# Altium schematic sheet HV_DAC_8ch-DIOT.schdoc: Fastino v1.3 DIOT
size A2; EDA_Number: ARTIQ; Projet: Fastino; Author: G.Kasprowicz; CompanyName: WUT ISE; DrawnBy: G.Kasprowicz; Organization: WUT ISE; Address1: PW ISE; Address2: Nowowiejska 15/19 00-665 Warsaw; Address3: gkasprow@gmail.com; DocumentNumber: 1; Revision: 2; SheetNumber: 1; SheetTotal: 12; ModifiedBy: -; CheckedDate: -; Title2: Top; DivGrp: WUT ISE; Designer: G.Kasprowicz; ModifiedDate: -; ProjectName: Sensor Box
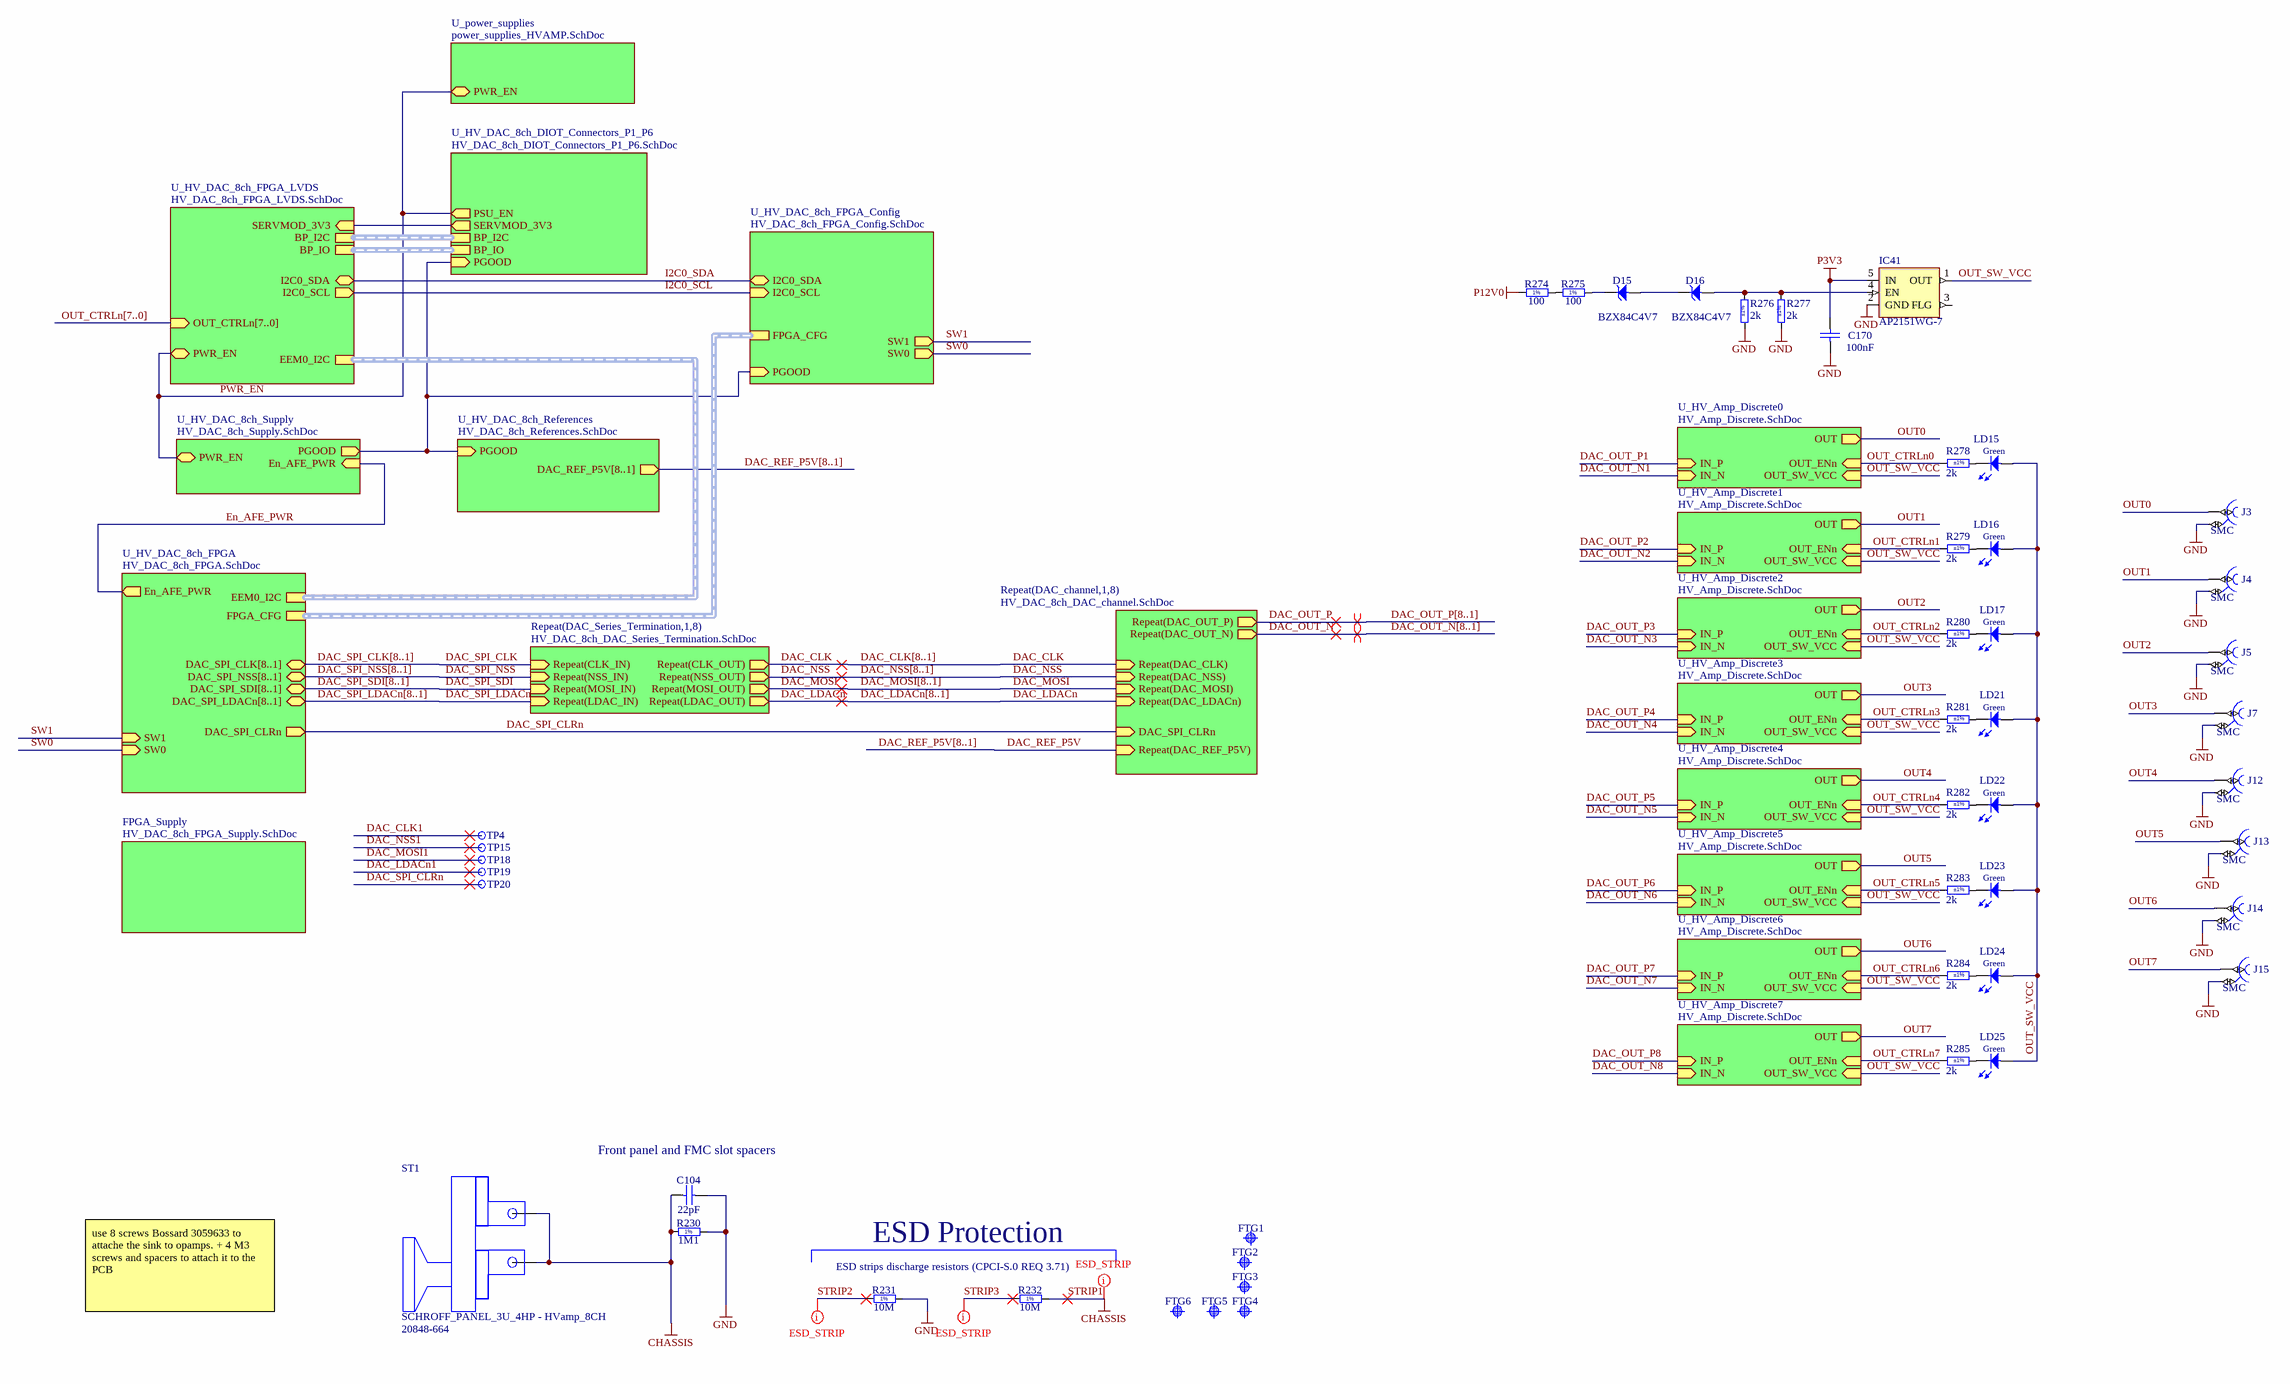
[diagram p0: HV_DAC_8ch-DIOT.schdoc]

## Parts
C104  22pF  [CAPC1005X55N]
C170  100nF  [CAPC1005X55N]
D15  BZX84C4V7  [SOT95P240X130-3N]
D16  BZX84C4V7  [SOT95P240X130-3N]
FTG1  Use only in PCB  [FIDUCIAL_TOP_C100-200]  (value not drawn)
FTG2  Use only in PCB  [FIDUCIAL_TOP_S100-200]  (value not drawn)
FTG3  Use only in PCB  [FIDUCIAL_TOP_S100-200]  (value not drawn)
FTG4  Use only in PCB  [FIDUCIAL_TOP_S100-200]  (value not drawn)
FTG5  Use only in PCB  [FIDUCIAL_TOP_S100-200]  (value not drawn)
FTG6  Use only in PCB  [FIDUCIAL_TOP_S100-200]  (value not drawn)
IC41  AP2151WG-7  [SOT23-5]
J3  SMC  [JOHNSON_131-6701-341]
J4  SMC  [JOHNSON_131-6701-341]
J5  SMC  [JOHNSON_131-6701-341]
J7  SMC  [JOHNSON_131-6701-341]
J12  SMC  [JOHNSON_131-6701-341]
J13  SMC  [JOHNSON_131-6701-341]
J14  SMC  [JOHNSON_131-6701-341]
J15  SMC  [JOHNSON_131-6701-341]
LD15  Green  [LED_AVAGO_HSME-C120]
LD16  Green  [LED_AVAGO_HSME-C120]
LD17  Green  [LED_AVAGO_HSME-C120]
LD21  Green  [LED_AVAGO_HSME-C120]
LD22  Green  [LED_AVAGO_HSME-C120]
LD23  Green  [LED_AVAGO_HSME-C120]
LD24  Green  [LED_AVAGO_HSME-C120]
LD25  Green  [LED_AVAGO_HSME-C120]
R230  1M1  [RESC2012X60N]
R231  10M  [RESC2113X55N]
R232  10M  [RESC2113X55N]
R274  100  [RESC1005X40N]
R275  100  [RESC1005X40N]
R276  2k  Tolerance: ±1%  [RESC1005X40N]
R277  2k  Tolerance: ±1%  [RESC1005X40N]
R278  2k  Tolerance: ±1%  [RESC1005X40N]
R279  2k  Tolerance: ±1%  [RESC1005X40N]
R280  2k  Tolerance: ±1%  [RESC1005X40N]
R281  2k  Tolerance: ±1%  [RESC1005X40N]
R282  2k  Tolerance: ±1%  [RESC1005X40N]
R283  2k  Tolerance: ±1%  [RESC1005X40N]
R284  2k  Tolerance: ±1%  [RESC1005X40N]
R285  2k  Tolerance: ±1%  [RESC1005X40N]
ST1  SCHROFF_PANEL_3U_4HP - HVamp_8CH  Manufacturer Part Number 2: 20848-664  [SCHROFF_PANEL_3U_4HP - HVamp_8CH]
TP4  Test Point  [TPS127]  (value not drawn)
TP15  Test Point  [TPS127]  (value not drawn)
TP18  Test Point  [TPS127]  (value not drawn)
TP19  Test Point  [TPS127]  (value not drawn)
TP20  Test Point  [TPS127]  (value not drawn)

## Sub-sheets
FPGA_Supply = HV_DAC_8ch_FPGA_Supply.SchDoc: no entries
Repeat(DAC_channel,1,8) = HV_DAC_8ch_DAC_channel.SchDoc: Repeat(DAC_OUT_P) (out), Repeat(DAC_OUT_N) (out), Repeat(DAC_CLK) (in), Repeat(DAC_NSS) (in), Repeat(DAC_MOSI) (in), DAC_SPI_CLRn (in), Repeat(DAC_LDACn) (in), Repeat(DAC_REF_P5V) (in)
Repeat(DAC_Series_Termination,1,8) = HV_DAC_8ch_DAC_Series_Termination.SchDoc: Repeat(CLK_IN) (in), Repeat(NSS_IN) (in), Repeat(MOSI_IN) (in), Repeat(LDAC_IN) (in), Repeat(CLK_OUT) (out), Repeat(NSS_OUT) (out), Repeat(LDAC_OUT) (out), Repeat(MOSI_OUT) (out)
U_HV_Amp_Discrete0 = HV_Amp_Discrete.SchDoc: OUT (out), IN_P (in), IN_N (in), OUT_ENn (in), OUT_SW_VCC (in)
U_HV_Amp_Discrete1 = HV_Amp_Discrete.SchDoc: OUT (out), IN_P (in), IN_N (in), OUT_ENn (in), OUT_SW_VCC (in)
U_HV_Amp_Discrete2 = HV_Amp_Discrete.SchDoc: OUT (out), IN_P (in), IN_N (in), OUT_ENn (in), OUT_SW_VCC (in)
U_HV_Amp_Discrete3 = HV_Amp_Discrete.SchDoc: OUT (out), IN_P (in), IN_N (in), OUT_ENn (in), OUT_SW_VCC (in)
U_HV_Amp_Discrete4 = HV_Amp_Discrete.SchDoc: OUT (out), IN_P (in), IN_N (in), OUT_ENn (in), OUT_SW_VCC (in)
U_HV_Amp_Discrete5 = HV_Amp_Discrete.SchDoc: OUT (out), IN_P (in), IN_N (in), OUT_ENn (in), OUT_SW_VCC (in)
U_HV_Amp_Discrete6 = HV_Amp_Discrete.SchDoc: OUT (out), IN_P (in), IN_N (in), OUT_ENn (in), OUT_SW_VCC (in)
U_HV_Amp_Discrete7 = HV_Amp_Discrete.SchDoc: OUT (out), IN_P (in), IN_N (in), OUT_ENn (in), OUT_SW_VCC (in)
U_HV_DAC_8ch_DIOT_Connectors_P1_P6 = HV_DAC_8ch_DIOT_Connectors_P1_P6.SchDoc: SERVMOD_3V3 (out), BP_I2C (harness I2C), BP_IO (harness EEM_LVDS), PSU_EN (out), PGOOD (in)
U_HV_DAC_8ch_FPGA = HV_DAC_8ch_FPGA.SchDoc: DAC_SPI_LDACn[8..1] (bidir), DAC_SPI_SDI[8..1] (bidir), DAC_SPI_NSS[8..1] (bidir), DAC_SPI_CLRn (out), DAC_SPI_CLK[8..1] (bidir), FPGA_CFG (harness FPGA_CFG), SW1 (in), SW0 (in), EEM0_I2C (harness I2C), En_AFE_PWR (out)
U_HV_DAC_8ch_FPGA_Config = HV_DAC_8ch_FPGA_Config.SchDoc: PGOOD (in), FPGA_CFG (harness FPGA_CFG), SW1 (out), SW0 (out), I2C0_SCL (in), I2C0_SDA (bidir)
U_HV_DAC_8ch_FPGA_LVDS = HV_DAC_8ch_FPGA_LVDS.SchDoc: EEM0_I2C (harness I2C), PWR_EN (bidir), OUT_CTRLn[7..0] (in), I2C0_SDA (bidir), I2C0_SCL (out), BP_IO (harness EEM_LVDS), BP_I2C (harness I2C), SERVMOD_3V3 (in)
U_HV_DAC_8ch_References = HV_DAC_8ch_References.SchDoc: PGOOD (in), DAC_REF_P5V[8..1] (out)
U_HV_DAC_8ch_Supply = HV_DAC_8ch_Supply.SchDoc: PGOOD (out), PWR_EN (bidir), En_AFE_PWR (in)
U_power_supplies = power_supplies_HVAMP.SchDoc: PWR_EN (bidir)

## Nets
GND: C104.2 C170.1 IC41.2(GND) J3.2 J4.2 J5.2 J7.2 J12.2 J13.2 J14.2 J15.2 R230.2 R231.2 R276.2 R277.2
P3V3: C170.2 IC41.5(IN)
P12V0: R274.1
STRIP1: C104.1 R230.1 R232.2 ST1.0 ST1.1  [also labelled CHASSIS]
DAC_CLK: sheet Repeat(DAC_channel,1,8)/Repeat(DAC_CLK), sheet Repeat(DAC_Series_Termination,1,8)/Repeat(CLK_OUT)
DAC_CLK1: TP4.1
DAC_LDACn: sheet Repeat(DAC_channel,1,8)/Repeat(DAC_LDACn), sheet Repeat(DAC_Series_Termination,1,8)/Repeat(LDAC_OUT)
DAC_LDACn1: TP19.1
DAC_MOSI: sheet Repeat(DAC_channel,1,8)/Repeat(DAC_MOSI), sheet Repeat(DAC_Series_Termination,1,8)/Repeat(MOSI_OUT)
DAC_MOSI1: TP18.1
DAC_NSS: sheet Repeat(DAC_channel,1,8)/Repeat(DAC_NSS), sheet Repeat(DAC_Series_Termination,1,8)/Repeat(NSS_OUT)
DAC_NSS1: TP15.1
DAC_OUT_N: sheet Repeat(DAC_channel,1,8)/Repeat(DAC_OUT_N)
DAC_OUT_N1: sheet U_HV_Amp_Discrete0/IN_N
DAC_OUT_N2: sheet U_HV_Amp_Discrete1/IN_N
DAC_OUT_N3: sheet U_HV_Amp_Discrete2/IN_N
DAC_OUT_N4: sheet U_HV_Amp_Discrete3/IN_N
DAC_OUT_N5: sheet U_HV_Amp_Discrete4/IN_N
DAC_OUT_N6: sheet U_HV_Amp_Discrete5/IN_N
DAC_OUT_N7: sheet U_HV_Amp_Discrete6/IN_N
DAC_OUT_N8: sheet U_HV_Amp_Discrete7/IN_N
DAC_OUT_P: sheet Repeat(DAC_channel,1,8)/Repeat(DAC_OUT_P)
DAC_OUT_P1: sheet U_HV_Amp_Discrete0/IN_P
DAC_OUT_P2: sheet U_HV_Amp_Discrete1/IN_P
DAC_OUT_P3: sheet U_HV_Amp_Discrete2/IN_P
DAC_OUT_P4: sheet U_HV_Amp_Discrete3/IN_P
DAC_OUT_P5: sheet U_HV_Amp_Discrete4/IN_P
DAC_OUT_P6: sheet U_HV_Amp_Discrete5/IN_P
DAC_OUT_P7: sheet U_HV_Amp_Discrete6/IN_P
DAC_OUT_P8: sheet U_HV_Amp_Discrete7/IN_P
DAC_REF_P5V: sheet Repeat(DAC_channel,1,8)/Repeat(DAC_REF_P5V)
DAC_SPI_CLK: sheet Repeat(DAC_Series_Termination,1,8)/Repeat(CLK_IN)
DAC_SPI_CLRn: TP20.1 ; sheet Repeat(DAC_channel,1,8)/DAC_SPI_CLRn, sheet U_HV_DAC_8ch_FPGA/DAC_SPI_CLRn
DAC_SPI_LDACn: sheet Repeat(DAC_Series_Termination,1,8)/Repeat(LDAC_IN)
DAC_SPI_NSS: sheet Repeat(DAC_Series_Termination,1,8)/Repeat(NSS_IN)
DAC_SPI_SDI: sheet Repeat(DAC_Series_Termination,1,8)/Repeat(MOSI_IN)
En_AFE_PWR: sheet U_HV_DAC_8ch_FPGA/En_AFE_PWR, sheet U_HV_DAC_8ch_Supply/En_AFE_PWR
I2C0_SCL: sheet U_HV_DAC_8ch_FPGA_Config/I2C0_SCL, sheet U_HV_DAC_8ch_FPGA_LVDS/I2C0_SCL
I2C0_SDA: sheet U_HV_DAC_8ch_FPGA_Config/I2C0_SDA, sheet U_HV_DAC_8ch_FPGA_LVDS/I2C0_SDA
OUT0: J3.1 ; sheet U_HV_Amp_Discrete0/OUT
OUT1: J4.1 ; sheet U_HV_Amp_Discrete1/OUT
OUT2: J5.1 ; sheet U_HV_Amp_Discrete2/OUT
OUT3: J7.1 ; sheet U_HV_Amp_Discrete3/OUT
OUT4: J12.1 ; sheet U_HV_Amp_Discrete4/OUT
OUT5: J13.1 ; sheet U_HV_Amp_Discrete5/OUT
OUT6: J14.1 ; sheet U_HV_Amp_Discrete6/OUT
OUT7: J15.1 ; sheet U_HV_Amp_Discrete7/OUT
OUT_CTRLn0: R278.2 ; sheet U_HV_Amp_Discrete0/OUT_ENn
OUT_CTRLn1: R279.2 ; sheet U_HV_Amp_Discrete1/OUT_ENn
OUT_CTRLn2: R280.2 ; sheet U_HV_Amp_Discrete2/OUT_ENn
OUT_CTRLn3: R281.2 ; sheet U_HV_Amp_Discrete3/OUT_ENn
OUT_CTRLn4: R282.2 ; sheet U_HV_Amp_Discrete4/OUT_ENn
OUT_CTRLn5: R283.2 ; sheet U_HV_Amp_Discrete5/OUT_ENn
OUT_CTRLn6: R284.2 ; sheet U_HV_Amp_Discrete6/OUT_ENn
OUT_CTRLn7: R285.2 ; sheet U_HV_Amp_Discrete7/OUT_ENn
OUT_SW_VCC: IC41.1(OUT) LD15.2(A) LD16.2(A) LD17.2(A) LD21.2(A) LD22.2(A) LD23.2(A) LD24.2(A) LD25.2(A) ; sheet U_HV_Amp_Discrete0/OUT_SW_VCC, sheet U_HV_Amp_Discrete1/OUT_SW_VCC, sheet U_HV_Amp_Discrete2/OUT_SW_VCC, sheet U_HV_Amp_Discrete3/OUT_SW_VCC, sheet U_HV_Amp_Discrete4/OUT_SW_VCC, sheet U_HV_Amp_Discrete5/OUT_SW_VCC, sheet U_HV_Amp_Discrete6/OUT_SW_VCC, sheet U_HV_Amp_Discrete7/OUT_SW_VCC
PWR_EN: sheet U_HV_DAC_8ch_FPGA_LVDS/PWR_EN, sheet U_HV_DAC_8ch_Supply/PWR_EN, sheet U_HV_DAC_8ch_DIOT_Connectors_P1_P6/PSU_EN, sheet U_power_supplies/PWR_EN
STRIP2: R231.1
STRIP3: R232.1
SW0: sheet U_HV_DAC_8ch_FPGA/SW0, sheet U_HV_DAC_8ch_FPGA_Config/SW0
SW1: sheet U_HV_DAC_8ch_FPGA/SW1, sheet U_HV_DAC_8ch_FPGA_Config/SW1
NetD15_1: D15.1(A) D16.3(C)
NetD15_3: D15.3(C) R275.2
NetD16_1: D16.1(A) IC41.4(EN) R276.1 R277.1
NetLD15_1: LD15.1(C) R278.1
NetLD16_1: LD16.1(C) R279.1
NetLD17_1: LD17.1(C) R280.1
NetLD21_1: LD21.1(C) R281.1
NetLD22_1: LD22.1(C) R282.1
NetLD23_1: LD23.1(C) R283.1
NetLD24_1: LD24.1(C) R284.1
NetLD25_1: LD25.1(C) R285.1
NetR274_2: R274.2 R275.1
(unnamed): sheet U_HV_DAC_8ch_FPGA_Config/PGOOD, sheet U_HV_DAC_8ch_References/PGOOD, sheet U_HV_DAC_8ch_Supply/PGOOD, sheet U_HV_DAC_8ch_DIOT_Connectors_P1_P6/PGOOD
(unnamed): sheet U_HV_DAC_8ch_FPGA_LVDS/SERVMOD_3V3, sheet U_HV_DAC_8ch_DIOT_Connectors_P1_P6/SERVMOD_3V3

Not connected (* = marked no-connect by the designer): IC41 3(FLG)

## Buses and harness runs
bus DAC_CLK[8..1]
bus DAC_LDACn[8..1]
bus DAC_MOSI[8..1]
bus DAC_NSS[8..1]
bus DAC_OUT_N[8..1]
bus DAC_OUT_P[8..1]
bus DAC_REF_P5V[8..1]
bus DAC_REF_P5V[8..1] = sheet U_HV_DAC_8ch_References/DAC_REF_P5V[8..1]
bus DAC_SPI_CLK[8..1] = sheet U_HV_DAC_8ch_FPGA/DAC_SPI_CLK[8..1]
bus DAC_SPI_LDACn[8..1] = sheet U_HV_DAC_8ch_FPGA/DAC_SPI_LDACn[8..1]
bus DAC_SPI_NSS[8..1] = sheet U_HV_DAC_8ch_FPGA/DAC_SPI_NSS[8..1]
bus DAC_SPI_SDI[8..1] = sheet U_HV_DAC_8ch_FPGA/DAC_SPI_SDI[8..1]
bus OUT_CTRLn[7..0] = sheet U_HV_DAC_8ch_FPGA_LVDS/OUT_CTRLn[7..0]
harness sheet U_HV_DAC_8ch_DIOT_Connectors_P1_P6/BP_I2C = sheet U_HV_DAC_8ch_FPGA_LVDS/BP_I2C
harness sheet U_HV_DAC_8ch_DIOT_Connectors_P1_P6/BP_IO = sheet U_HV_DAC_8ch_FPGA_LVDS/BP_IO
harness sheet U_HV_DAC_8ch_FPGA/EEM0_I2C = sheet U_HV_DAC_8ch_FPGA_LVDS/EEM0_I2C
harness sheet U_HV_DAC_8ch_FPGA/FPGA_CFG = sheet U_HV_DAC_8ch_FPGA_Config/FPGA_CFG

## Layout directives
differential pair: DAC_OUT_N, DAC_OUT_P
net class ESD_STRIP: STRIP1, STRIP2, STRIP3

## Notes on the sheet
- (near C104) Front panel and FMC slot spacers
- ESD strips discharge resistors (CPCI-S.0 REQ 3.71)
- ESD Protection
- use 8 screws Bossard 3059633 to attache the sink to opamps. + 4 M3 screws and spacers to attach it to the PCB
- Project/Equipment
- Document
- Designer
- Drawn by
- Check.by
- Last Mod.
- Contact
- File
- Print Date
- Sheet
- Size
- A2
- of
- Rev
- (in symbol R0402_100R_1%_0.0625W_100PPM) 1%
- (in symbol R0805_1M1_1%_0.125W_100PPM) 1%
- (in symbol R0805_10M_1%_0.125W_100PPM_VISHAY_CRCW e3) 1%

## Library data of the parts
C104 = CC0402_22PF_50V_5%_C0G: Non-polarised capacitor; Part Description: SMD Multilayer Chip Ceramic Capacitor; Manufacturer: GENERIC; Manufacturer1 Part Number: C0402C220J5GACTU; Voltage: 50V; TC: C0G/NP0; Tolerance: ±5%; Part Number: CC0402_22PF_50V_5%_C0G; Component Kind: Standard; Component Type: Standard; Pin Count: 2; Value: 22pF; Status: Preferred; Manufacturer Part Number: CC0402_22PF_50V_5%_C0G; Case: 0402; Mounted: Yes; Socket: No; SMD: Yes; Manufacturer1 Example: KEMET; Manufacturer1 ComponentHeight: 0.55mm; HelpURL: \\cern.ch\dfs\Applications\Altium\Datasheets\CC0402_C0G_KEMET_(Commercial Grade).pdf; Author: CERN DEM JLC; CreateDate: 2007-12-03; LatestRevisionDate: 2007-12-03; Sense: No
C170 = CC0402_100NF_16V_10%_X5R: Non-polarised capacitor; Part Description: SMD Multilayer Chip Ceramic Capacitor; Manufacturer: GENERIC; Manufacturer1 Part Number: GRM155R61C104KA88D; Voltage: 16V; TC: X5R; Tolerance: ±10%; Part Number: CC0402_100NF_16V_10%_X5R; Component Kind: Standard; Component Type: Standard; Pin Count: 2; Value: 100nF; Status: None; Manufacturer Part Number: CC0402_100NF_16V_10%_X5R; Case: 0402; Mounted: Yes; Socket: No; SMD: Yes; Sense: No; Manufacturer1 Example: MURATA; Manufacturer1 ComponentHeight: 0.55mm; HelpURL: \\cern.ch\dfs\Applications\Altium\Datasheets\CC0402_X5R_MURATA_GRM.pdf; Author: CERN DEM JLC; CreateDate: 10.12.2013; LatestRevisionDate: 10.12.2013
D15 D16 = BZX84C4V7: Diode Zener Anode Pin 1 Cathode Pin 3 (Pas de pin 2); Part Description: Zener Diode; Manufacturer: FAIRCHILD SEMICONDUCTOR; Voltage: 4V7; Power: 350mW; PressFit: No; Bonding: No; Part Number: BZX84C4V7; Component Kind: Standard; Component Type: Standard; Device: BZX84C4V7; PackageDescription: SOT, 0.95mm Pitch; 3 Pin, 1.30mm W X 2.90mm L X 1.30mm H body, IPC Medium Density; Manufacturer Part Number: BZX84C4V7; Pin Count: 3; Case: SOT23-3; Mounted: Yes; Socket: No; SMD: Yes; Sense: No; ComponentHeight: 1.3mm; HelpURL: \\cern.ch\dfs\Applications\Altium\Datasheets\BZX84C4V7.pdf; Author: CERN DEM JLC; CreateDate: 15.06.2011; LatestRevisionDate: 15.06.2011
FTG1 = FIDUCIAL_TARGET_C100-200: Fiducial Target; Part Description: Round Fiducial Target, Top Layer, 1.0mm, Top Solder 2.0mm, Keepout =2.0mm; Mounted: No; Part Number: FIDUCIAL_TARGET_C100-200; Component Kind: Standard (No BOM); Component Type: Standard (No BOM); Pin Count: 1; Family: Fiducial; Socket: No; SMD: Yes; Sense: No; Status: None; ComponentHeight: 0mm; HelpURL: Undefined; Author: CERN DEM JLC; CreateDate: 09.02.2010; LatestRevisionDate: 04.04.2012; PackageDescription: Round Fiducial Target, Top Layer, 1.0mm, Top Solder 2.0mm, Keepout =2.0mm
FTG2-FTG6 = FIDUCIAL_TARGET_S100-200: Fiducial Target; Part Description: Square Fiducial Target, Top Layer, 1.0mm, Top Solder 2.0mm, Keepout =2.0mm; Mounted: No; Part Number: FIDUCIAL_TARGET_S100-200; Component Kind: Standard (No BOM); Component Type: Standard (No BOM); Pin Count: 1; Family: Fiducial; Socket: No; SMD: Yes; Sense: No; Status: None; ComponentHeight: 0mm; HelpURL: Undefined; Author: CERN DEM JLC; CreateDate: 09.02.2010; LatestRevisionDate: 04.04.2012; PackageDescription: Square Fiducial Target, Top Layer, 1.0mm, Top Solder 2.0mm, Keepout =2.0mm
IC41 = IFC_AP2151: 0.5A SINGLE CHANNEL CURRENT- LIMITED POWER Switch
J3-J5 J7 J12-J15 = JOHNSON_131-6701-341: Part Description: SMC 50 Ohms Right Angle Bulkhead Jack Receptacle; PressFit: No; Part Number: JOHNSON_131-6701-341; Component Kind: Standard; Component Type: Standard; Pin Count: 2; Family: SMC; Mounted: Yes; Socket: No; SMD: No; Sense: No; Status: None; Manufacturer: JOHNSON; Manufacturer Part Number: 131-6701-341; ComponentHeight: 7.67mm; HelpURL: \\cern.ch\dfs\Applications\Altium\Datasheets\JOHNSON_131-6701-341.pdf; Author: CERN DEM JLC; CreateDate: 16.02.2010; LatestRevisionDate: 12.01.2017
LD15-LD17 LD21-LD25 = LED_AVAGO_HSME-C120: LED Green 1C 2A; Part Description: High Performance Right Angle Chip Green LED; Manufacturer: AVAGO TECHNOLOGIES; PressFit: No; Bonding: No; Part Number: LED_AVAGO_HSME-C120; Component Kind: Standard; Component Type: Standard; Color: Green; PackageDescription: Green Chip LED, 2-Leads, Body 1.7x1.1mm, Side Emitting Package; Manufacturer Part Number: HSME-C120; Pin Count: 2; Mounted: Yes; Socket: No; SMD: Yes; Sense: No; ComponentHeight: 0.7mm; HelpURL: \\cern.ch\dfs\Applications\Altium\Datasheets\LED_AVAGO_HSME-C120.pdf; ComponentLink1URL: \\cern.ch\dfs\Applications\Altium\Datasheets\LED_AVAGO_HSME-C110_DESIGN-GUIDE.pdf; ComponentLink1Description: Design Guide; Author: CERN DEM JMW; CreateDate: 22.07.2009; LatestRevisionDate: 20.06.2012
R230 = R0805_1M1_1%_0.125W_100PPM: Resistor - 1%; Part Description: General Purpose Thick Film Chip Resistor; Manufacturer: GENERIC; Manufacturer1 Part Number: NRC10F1104TRF; Power: 0.125W; TC: ±100ppm/°C; PressFit: No; Part Number: R0805_1M1_1%_0.125W_100PPM; Component Kind: Standard; Component Type: Standard; Pin Count: 2; Value: 1M1; Status: Preferred; Tolerance: ±1%; Manufacturer Part Number: R0805_1M1_1%_0.125W_100PPM; Case: 0805; Mounted: Yes; Sense: No; Socket: No; SMD: Yes; Manufacturer1 Example: NIC COMPONENT; Manufacturer1 ComponentHeight: 0.6mm; HelpURL: \\cern.ch\dfs\Applications\Altium\Datasheets\R0805_NIC_NRC.pdf; Author: CERN DEM JLC; CreateDate: 03/12/2007; LatestRevisionDate: 13/03/2008
R231 R232 = R0805_10M_1%_0.125W_100PPM_VISHAY_CRCW e3: Resistor - 1%; Part Description: 150V, Standard Thick Film Chip Resistor; Manufacturer: VISHAY DALE; Manufacturer Part Number: CRCW080510M0FKEA; Power: 0.125W; TC: ±100ppm/°C; PressFit: No; Part Number: R0805_10M_1%_0.125W_100PPM_VISHAY_CRCW e3; Component Kind: Standard; Component Type: Standard; Pin Count: 2; Value: 10M; Status: None; Tolerance: ±1%; Case: 0805; Mounted: Yes; Sense: No; Socket: No; SMD: Yes; ComponentHeight: 0.5mm; HelpURL: \\cern.ch\dfs\Applications\Altium\Datasheets\R0805_VISHAY_CRCW e3.pdf; Author: CERN DEM BC; CreateDate: 2019-11-12; LatestRevisionDate: 2019-11-12
R274 R275 = R0402_100R_1%_0.0625W_100PPM: Resistor - 1%; Part Description: General Purpose Thick Film Chip Resistor; Manufacturer: GENERIC; Manufacturer1 Part Number: 232270671001L; TC: ±100ppm/°C; PressFit: No; Part Number: R0402_100R_1%_0.0625W_100PPM; Component Kind: Standard; Component Type: Standard; Pin Count: 2; Value: 100; Status: Not Recommended; Power: 0.0625W; Tolerance: ±1%; Manufacturer Part Number: R0402_100R_1%_0.0625W_100PPM; Case: 0402; Mounted: Yes; Sense: No; Socket: No; SMD: Yes; Manufacturer1 Example: YAGEO PHYCOMP; Manufacturer1 ComponentHeight: 0.4mm; HelpURL: \\cern.ch\dfs\Applications\Altium\Datasheets\R0402_Phycomp_RC0402.pdf; Author: CERN DEM JLC; CreateDate: 03.12.2007; LatestRevisionDate: 17.10.2012
R276-R285 = R0402_2K_1%_0.0625W_100PPM: Resistor - 1%; Part Description: General Purpose Thick Film Chip Resistor; Manufacturer: GENERIC; Manufacturer1 Part Number: 232270672002L; TC: ±100ppm/°C; PressFit: No; Part Number: R0402_2K_1%_0.0625W_100PPM; Component Kind: Standard; Component Type: Standard; Pin Count: 2; Value: 2k; Status: Not Recommended; Power: 0.0625W; Manufacturer Part Number: R0402_2K_1%_0.0625W_100PPM; Case: 0402; Mounted: Yes; Sense: No; Socket: No; SMD: Yes; Manufacturer1 Example: YAGEO PHYCOMP; Manufacturer1 ComponentHeight: 0.4mm; HelpURL: \\cern.ch\dfs\Applications\Altium\Datasheets\R0402_Phycomp_RC0402.pdf; Author: CERN DEM JLC; CreateDate: 03.12.2007; LatestRevisionDate: 17.10.2012
ST1 = SCHROFF_PANEL_3U_4HP - HVamp_8CH: Schroff 3HP 4U EUROCARD Panel; Manufacturer Part Number: 20818-017; Manufacturer: Schroff
TP4 TP15 TP18-TP20 = SMD_PAD_1.27X1.27MM: Part Description: 1.27mm x 1.27mm PCB Copper Area (SMD Test Point); Mounted: No; Part Number: SMD_PAD_1.27X1.27MM; Component Kind: Standard (No BOM); Component Type: Standard (No BOM); Pin Count: 1; Family: Test Point; Socket: No; SMD: No; Sense: No; Status: None; ComponentHeight: 0mm; HelpURL: Undefined; Author: CERN DEM JLC; CreateDate: 12.01.2008; LatestRevisionDate: 12.01.2008; PackageDescription: 1.27mm x 1.27mm PCB Copper Area (SMD Test Point)